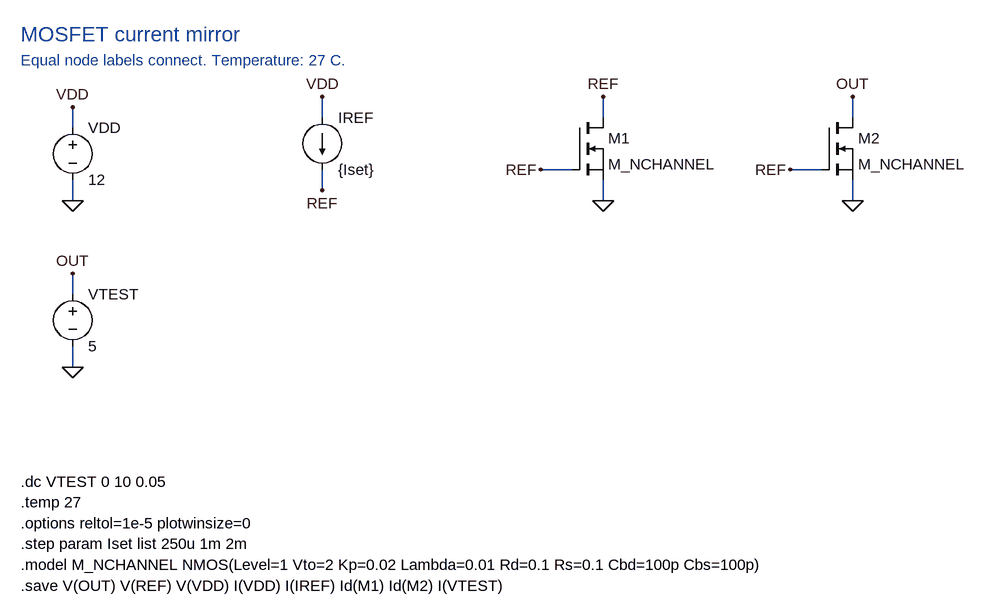
[diagram p0: schematic mosfet-current-mirror.asc]
mosfet-current-mirror.asc, the LTspice schematic file:
Version 4
SHEET 1 1740 1032
WIRE 144 176 144 144
WIRE 144 256 144 288
WIRE 528 160 528 128
WIRE 528 240 528 272
WIRE 960 160 960 128
WIRE 912 240 864 240
WIRE 960 256 960 288
WIRE 1344 160 1344 128
WIRE 1296 240 1248 240
WIRE 1344 256 1344 288
WIRE 144 432 144 400
WIRE 144 512 144 544
FLAG 144 144 VDD
FLAG 144 288 0
FLAG 528 128 VDD
FLAG 528 272 REF
FLAG 960 128 REF
FLAG 864 240 REF
FLAG 960 288 0
FLAG 1344 128 OUT
FLAG 1248 240 REF
FLAG 1344 288 0
FLAG 144 400 OUT
FLAG 144 544 0
SYMBOL voltage 144 160 R0
SYMATTR InstName VDD
SYMATTR Value 12
SYMBOL current 528 160 R0
SYMATTR InstName IREF
SYMATTR Value {Iset}
SYMBOL nmos 912 160 R0
SYMATTR InstName M1
SYMATTR Value M_NCHANNEL
SYMBOL nmos 1296 160 R0
SYMATTR InstName M2
SYMATTR Value M_NCHANNEL
SYMBOL voltage 144 416 R0
SYMATTR InstName VTEST
SYMATTR Value 5
TEXT 64 32 Left 3 ;MOSFET current mirror
TEXT 64 72 Left 2 ;Equal node labels connect. Temperature: 27 C.
TEXT 64 720 Left 2 !.dc VTEST 0 10 0.05
TEXT 64 752 Left 2 !.temp 27
TEXT 64 784 Left 2 !.options reltol=1e-5 plotwinsize=0
TEXT 64 816 Left 2 !.step param Iset list 250u 1m 2m
TEXT 64 848 Left 2 !.model M_NCHANNEL NMOS(Level=1 Vto=2 Kp=0.02 Lambda=0.01 Rd=0.1 Rs=0.1 Cbd=100p Cbs=100p)
TEXT 64 880 Left 2 !.save V(OUT) V(REF) V(VDD) I(VDD) I(IREF) Id(M1) Id(M2) I(VTEST)

The netlist it stands for:
* mosfet-current-mirror.asc
VDD VDD 0 12
IREF VDD REF {Iset}
M1 REF REF 0 0 M_NCHANNEL
M2 OUT REF 0 0 M_NCHANNEL
VTEST OUT 0 5
.model NMOS NMOS
.model PMOS PMOS
.lib standard.mos
* MOSFET current mirror
* Equal node labels connect. Temperature: 27 C.
.dc VTEST 0 10 0.05
.temp 27
.options reltol=1e-5 plotwinsize=0
.step param Iset list 250u 1m 2m
.model M_NCHANNEL NMOS(Level=1 Vto=2 Kp=0.02 Lambda=0.01 Rd=0.1 Rs=0.1 Cbd=100p Cbs=100p)
.save V(OUT) V(REF) V(VDD) I(VDD) I(IREF) Id(M1) Id(M2) I(VTEST)
.backanno
.end